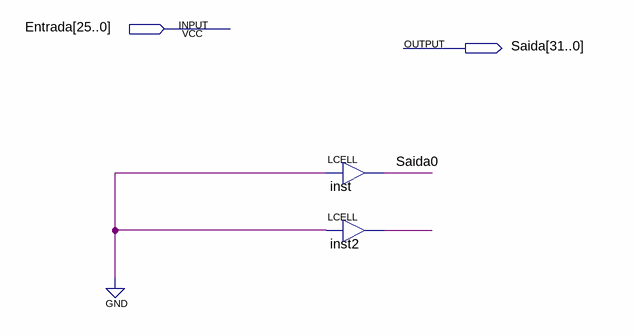
[diagram p0: schematic sheet]
// Quartus schematic Desloca.bdf as structural Verilog: 2 symbols, 2 pins
module Desloca (
  input  [25:0] Entrada,
  output [31:0] Saida
);

  wire inst2_out;

  LCELL inst (.IN(1'b0), .OUT(Saida[0]));
  LCELL inst2 (.IN(1'b0), .OUT(inst2_out));
endmodule
